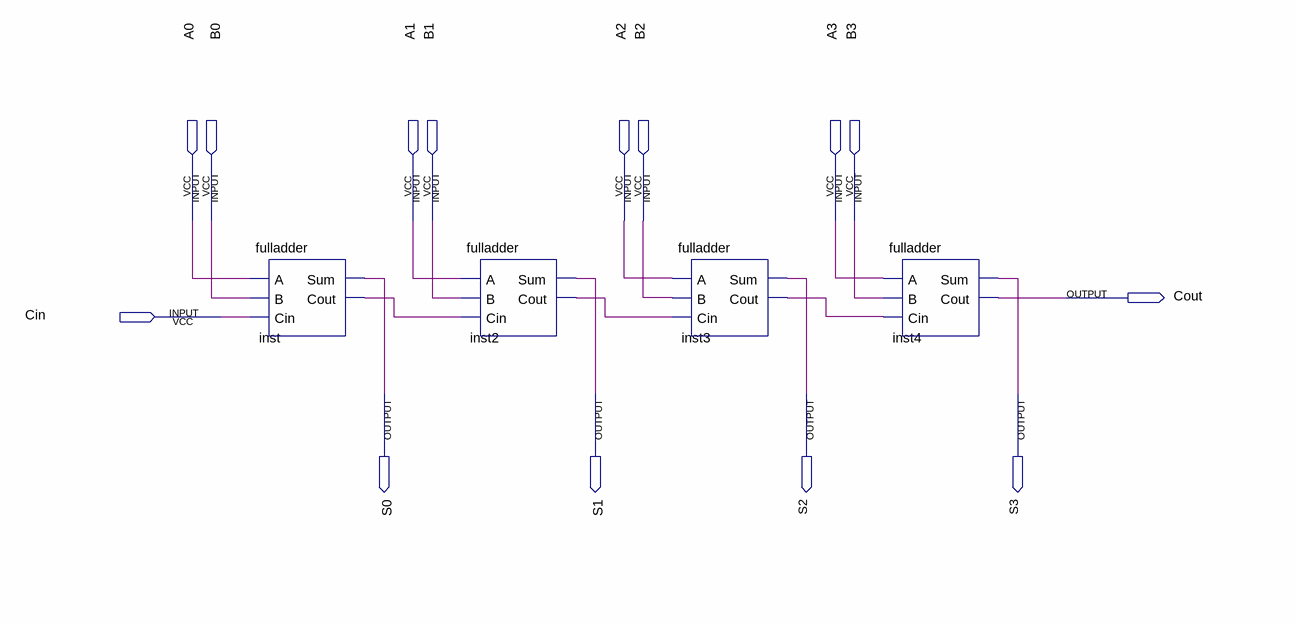
[diagram p0: schematic sheet]
// Quartus schematic fourbitripplecarryadder.bdf as structural Verilog: 4 symbols, 14 pins
module fourbitripplecarryadder (
  input  A0,
  input  B0,
  input  A1,
  input  B1,
  input  A2,
  input  B2,
  input  A3,
  input  B3,
  input  Cin,
  output Cout,
  output S0,
  output S1,
  output S2,
  output S3
);

  wire inst2_cout, inst3_cout, inst_cout;

  fulladder inst (.A(A0), .B(B0), .Cin(Cin), .Sum(S0), .Cout(inst_cout));
  fulladder inst2 (.A(A1), .B(B1), .Cin(inst_cout), .Sum(S1), .Cout(inst2_cout));
  fulladder inst3 (.A(A2), .B(B2), .Cin(inst2_cout), .Sum(S2), .Cout(inst3_cout));
  fulladder inst4 (.A(A3), .B(B3), .Cin(inst3_cout), .Sum(S3), .Cout(Cout));
endmodule
